# Altium schematic sheet 0_BlockDiagram.SchDoc
size A4; SheetNumber: 1; SheetTotal: 2
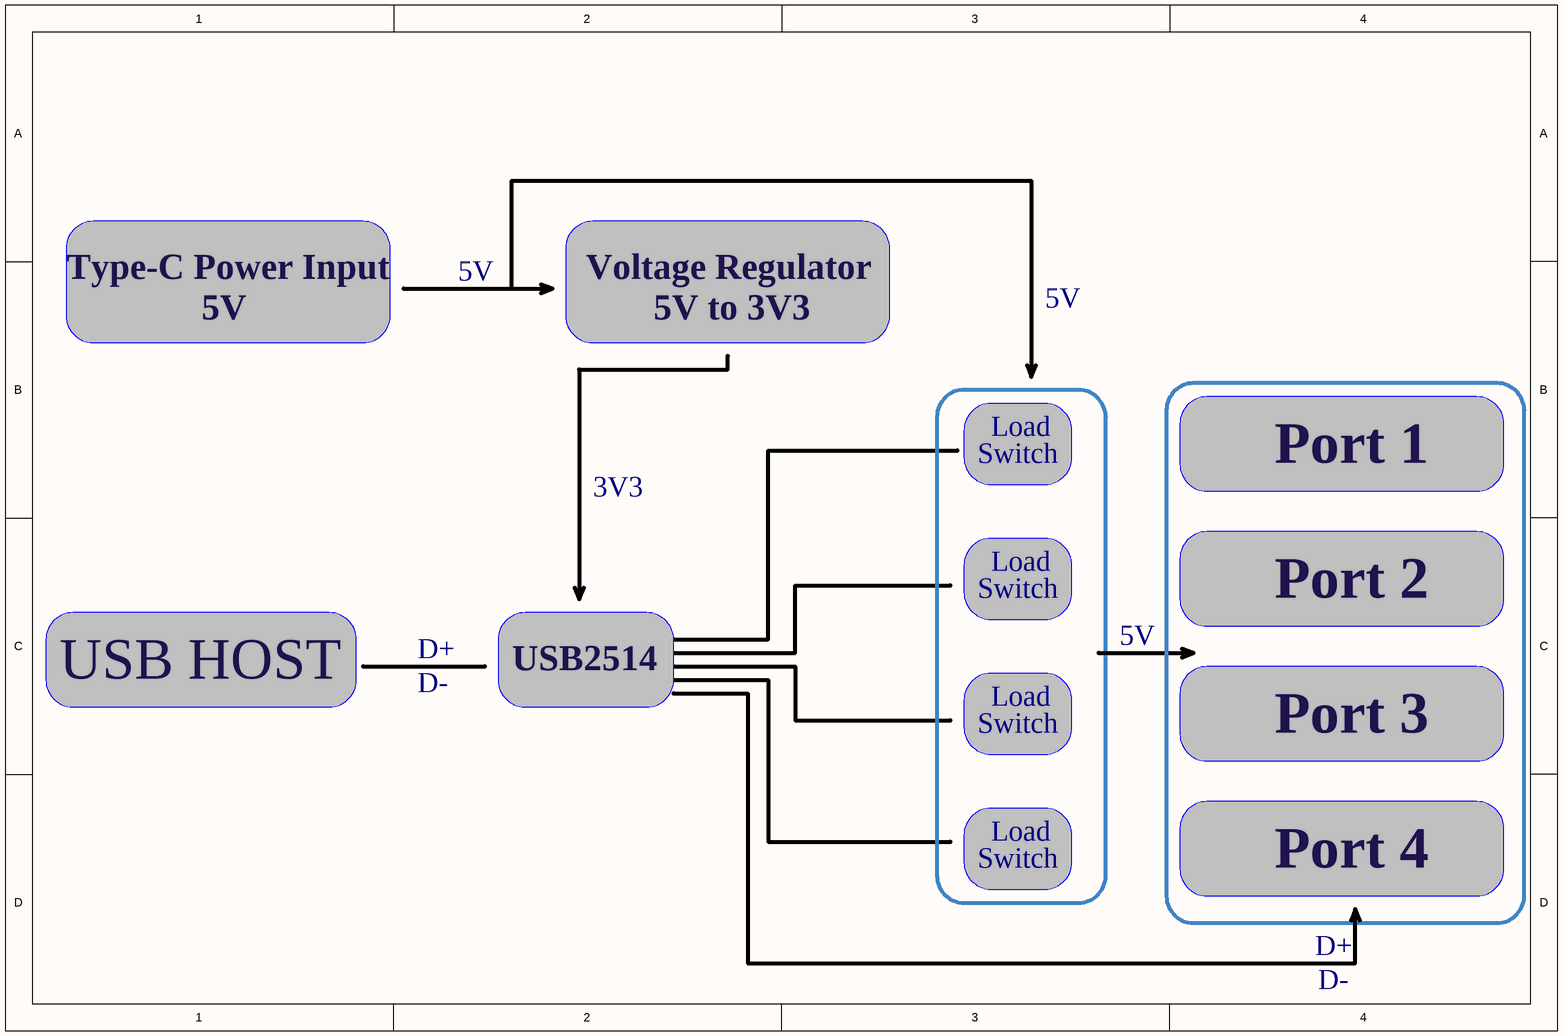
[diagram p0: 0_BlockDiagram.SchDoc]

## Notes on the sheet
- Type-C Power Input
- 5V
- Voltage Regulator
- 5V to 3V3
- Load
- 3V3
- Switch
- Port 1
- USB HOST
- Port 2
- D+
- D-
- USB2514
- Port 3
- Port 4
- DWG. NO.
- REV.
- SHT.
- THIS DOCUMENT AND THE DATA DISCLOSED HEREIN OR HEREWITH IS THE PROPERTY OF ALTIUM LIMITED AND MAY BE FREELY DISTRIBUTED IN WHOLE. NO RIGHTS ARE RESERVED OR EXPRESS OR IMPLIED WARANTEE GIVEN.
- REVISION
- DESCRIPTION
- DATE
- APPROVED
- ENG:
- APPROVALS
- PROJECT
- DSN:
- CHK:
- REFERENCE DOCUMENTS
- PROJECT REVISION:
- TITLE
- DOCUMENT REVISION:
- DESIGN ITEM:
- BOM:
- FAB DWG:
- PCB DWG:
- ASSY DWG:
- SCALE:
- SIZE
- B
- CAGE CODE
- FILE NAME
- DWG NO.
- SHEET
- OF
- REV